# EAGLE design LightBox Schematic Updated 11-27 (EAGLE 9.2.0)
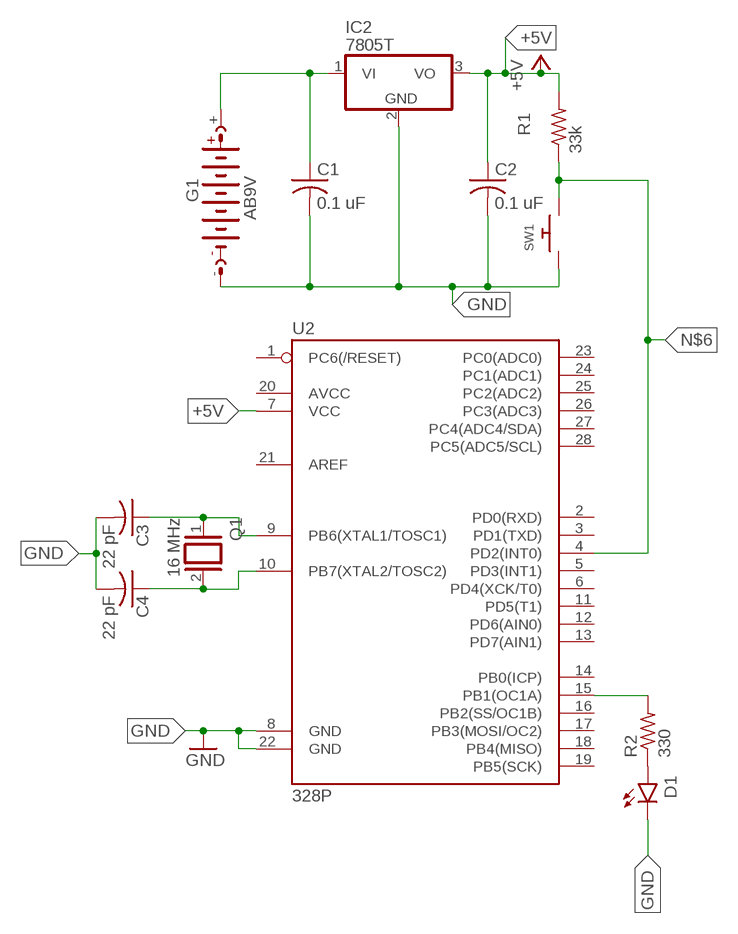
[diagram p0: schematic, sheet 1]

## Parts
C1  0.1 uF  C-USC0805  [C0805]
C2  0.1 uF  C-USC0805  [C0805]
C3  22 pF  C-USC0805  [C0805]
C4  22 pF  C-USC0805  [C0805]
D1  LED3MM  [LED_3MM]
G1  AB9V  [AB9V]
IC2  7805T  [TO220H]
Q1  16 MHz  XTAL/S  [QS]
R1  33k  R-US_R0805  [R0805]
R2  330  R-US_R0805  [R0805]
SW1  SWITCH_PUSHBUTTONEVQ-PE  [TACT_PANA-EVQ]
U2  328P  ATMEGA328P_PDIP  [DIP28]

## Nets
+5V: C2.1 IC2.3(VO) R1.2 U2.7(VCC)
GND: C1.2 C2.2 C3.2 C4.2 D1.K(C) G1.- IC2.2(GND) SW1.P$1 U2.8(GND) U2.22(GND)
N$1: C1.1 G1.+ IC2.1(VI)
N$2: R2.2 U2.15(PB1(OC1A))
N$3: C4.1 Q1.2 U2.10(PB7(XTAL2/TOSC2))
N$4: D1.A R2.1
N$5: C3.1 Q1.1 U2.9(PB6(XTAL1/TOSC1))
N$6: R1.1 SW1.P$2 U2.4(PD2(INT0))
Unconnected: U2.1(PC6(/RESET)) U2.2(PD0(RXD)) U2.3(PD1(TXD)) U2.5(PD3(INT1)) U2.6(PD4(XCK/T0)) U2.11(PD5(T1)) U2.12(PD6(AIN0)) U2.13(PD7(AIN1)) U2.14(PB0(ICP)) U2.16(PB2(SS/OC1B)) U2.17(PB3(MOSI/OC2)) U2.18(PB4(MISO)) U2.19(PB5(SCK)) U2.20(AVCC) U2.21(AREF) U2.23(PC0(ADC0)) U2.24(PC1(ADC1)) U2.25(PC2(ADC2)) U2.26(PC3(ADC3)) U2.27(PC4(ADC4/SDA)) U2.28(PC5(ADC5/SCL))

## Library data of the parts
C1-C4 = adafruit:C-US: CAPACITOR, American symbol
D1 = SparkFun-LED:LED: LED (Generic) Standard schematic elements and footprints for 5mm, 3mm, 1206, and 0603 sized LEDs. Generic LEDs with no color specified.; PROD_ID: DIO-08794
G1 = battery:AB9V: 9-V BATTERY CLIP
IC2 = adafruit:78*: Positive VOLTAGE REGULATOR Added bigger pads to the TO-92 package
Q1 = special:XTAL/S: CRYSTAL
R1 R2 = adafruit:R-US_: RESISTOR, American symbol
SW1 = adafruit:SWITCH_PUSHBUTTON: Buttons SOFTTOUCHSMD_SJ - Soft touch temporary push button (Super Junk Akihabara) Compatible with SKPMANE010 [Mouser: 688-SKPMAN] C&K_KSS = Digikey: KSS221GLFS
U2 = SparkFun-IC-Microcontroller:ATMEGA328P_PDIP: Atmel 328P Through hole ATMEGA328P uC used in the Arduino 32kb flash, 1k EEPROM, 2k SRAM Datasheet <http://www.sparkfun.com/datasheets/Components/SMD/ATMega328.pdf> SparkFun Products Storefront component: AVR 28 Pin 20MHz 32K 6A/D - ATMega328P <https://www.sparkfun.com/products/9061> (COM-09061) SparkFun Simon Says - Through-Hole Soldering Kit <https://www.sparkfun.com/products/10547> (KIT-10547) SparkFun Learn to Solder - Simon Says <https://www.sparkfun.com/products/13708> (KIT-13708) SparkFun BigTime Watch Kit <https://www.sparkfun.com/products/11734> (KIT-11734) SparkFun ClockIt <https://www.sparkfun.com/products/10930> (KIT-10930) SparkFun Serial Enabled LCD Kit <https://www.sparkfun.com/products/10097> (LCD-10097) SparkFun Simon Tilts - Through Hole Soldering Kit <https://www.sparkfun.com/products/12634> (KIT-12634) SparkFun Frequency Counter Kit <https://www.sparkfun.com/products/10140> (KIT-10140) FabFM Radio Kit <https://www.sparkfun.com/products/11043> (KIT-11043) SparkFun Binary Blaster Kit <https://www.sparkfun.com/products/12037> (KIT-12037) SparkFun Metro-Gnome <https://www.sparkfun.com/products/9236> (KIT-09236) ATmega328 with Arduino Optiboot (Uno) <https://www.sparkfun.com/products/10524> (DEV-10524); PROD_ID: IC-09136

## Net classes
0 default: width 0.508 mm, drill 0.508 mm, clearance 0.508 mm

## Board
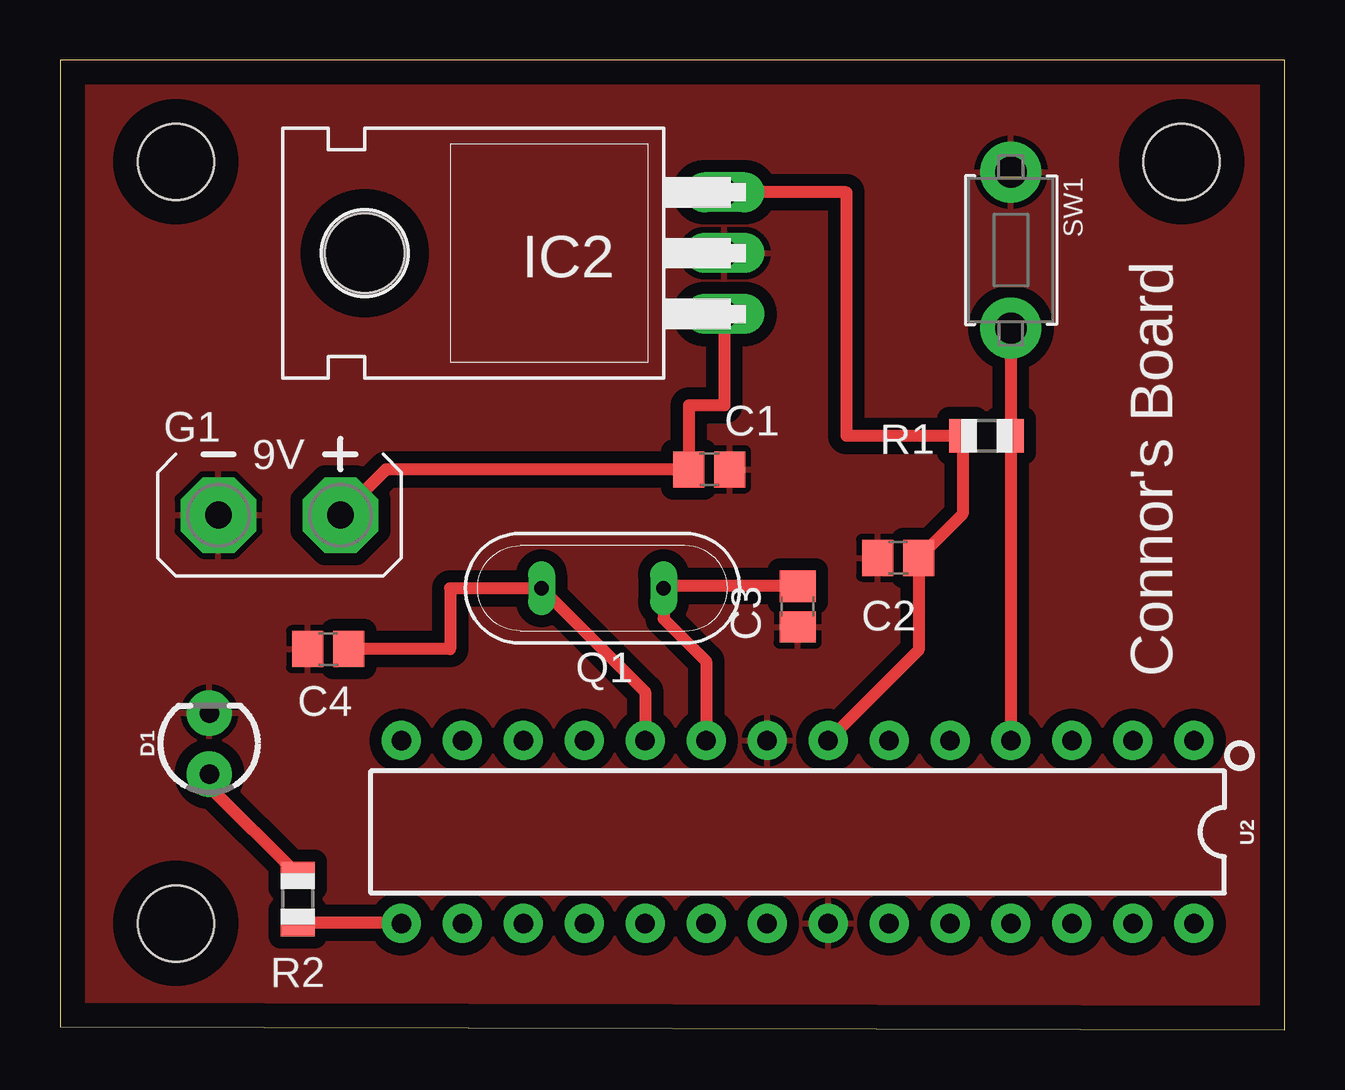
[diagram p1: board, top side]
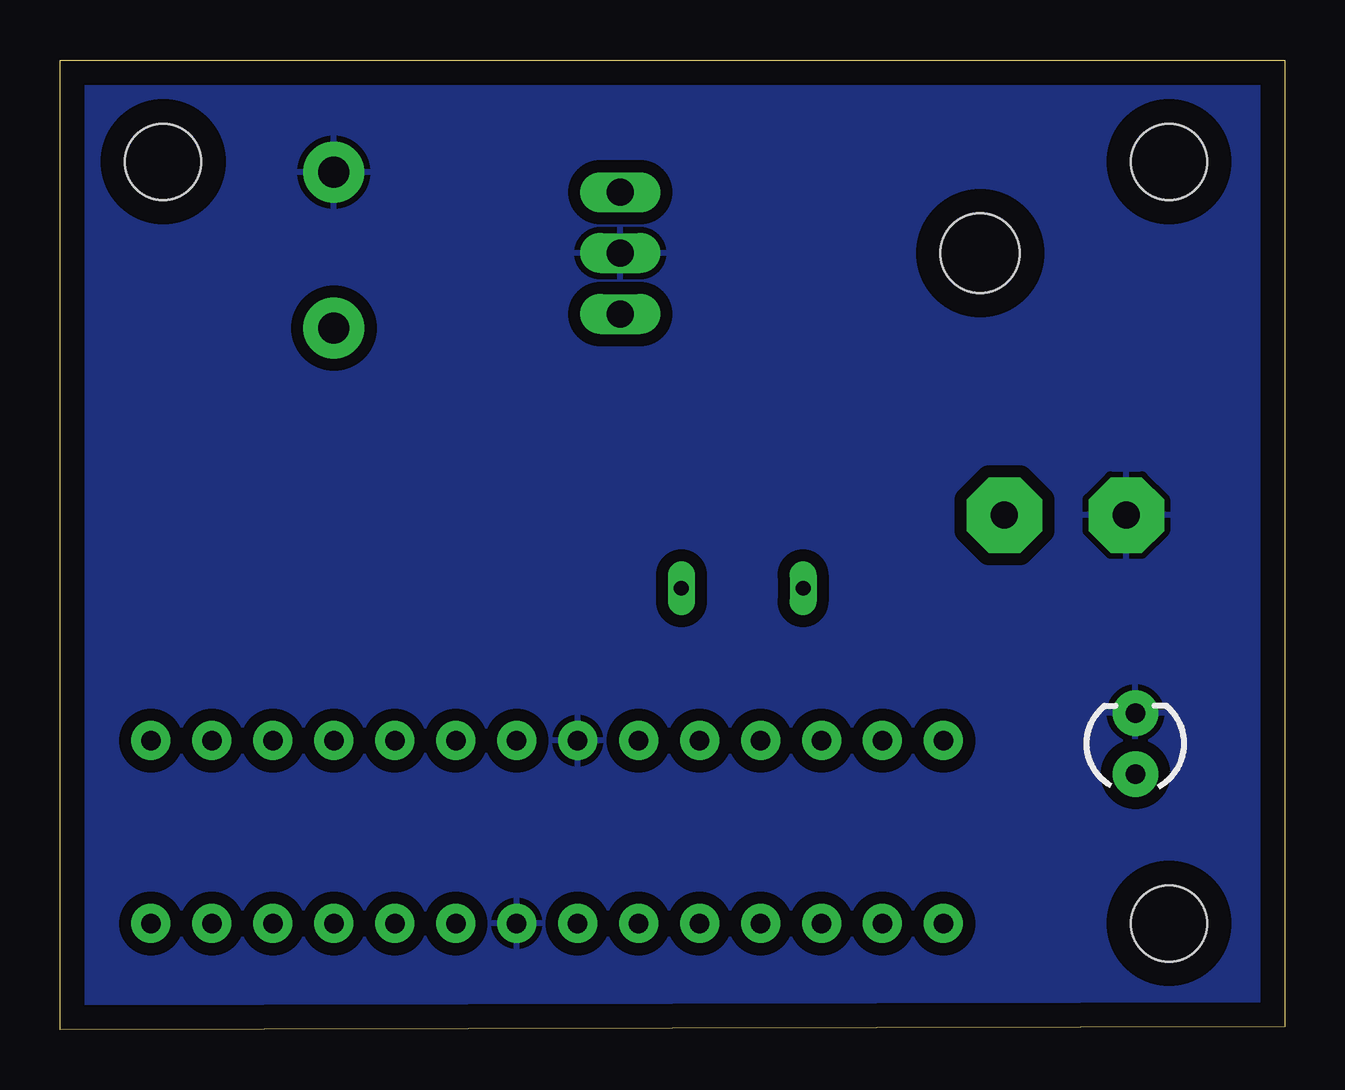
[diagram p2: board, bottom side, seen from below]

Size 51.03 x 40.44 mm. Coordinates in mm from the lower left corner, seen from the top.
Outline: 0,0.13 51.03,0 51.03,40.44 0,40.44 0,0.13
Copper layers (1*16): Top 0.035mm / dielectric 1.5mm / Bottom 0.035mm
Design rules "default *": minimum track width 12mil, minimum drill 0.35mm, track to track 6mil, track to pad 6mil, pad to pad 6mil, via to via 6mil, smd to smd 6mil, copper to edge 40mil, drill to drill 12mil, minimum pad ring 10mil, minimum via ring 8mil, stop-mask expansion 4mil, vias tented up to drill 0mil, thermal gap 10mil
Holes 3.17 mm at 4.83,36.2 4.83,4.44 46.74,36.2

### Footprints (pad centres in the part's own frame; a part is rotated, then mirrored left to right if it is on the bottom)
C0805 = smd 1.3 x 1.5: 1 -0.85,0; 2 0.85,0
LED_3MM = drill 0.813 pad 1.88: A -1.27,0; K 1.27,0
AB9V = drill 1.118 pad 3.15 octagon: + 0,2.54; - 0,-2.54
TO220H = drill 1.118 long: 1 -2.54,-10.16; 2 0,-10.16; 3 2.54,-10.16 | hole 3.302: 0,4.826
QS = drill 0.61 long: 1 -2.54,0; 2 2.54,0
R0805 = smd 1.1 x 1.4: 1 -1,0; 2 1,0
TACT_PANA-EVQ = drill 1.3 pad 2.54: P$1 -3.25,0; P$2 3.25,0
DIP28 = drill 0.813 pad 1.626: 1 -16.51,-3.81; 2 -13.97,-3.81; 3 -11.43,-3.81; 4 -8.89,-3.81; 5 -6.35,-3.81; 6 -3.81,-3.81; 7 -1.27,-3.81; 8 1.27,-3.81; 9 3.81,-3.81; 10 6.35,-3.81; 11 8.89,-3.81; 12 11.43,-3.81; 13 13.97,-3.81; 14 16.51,-3.81; 15 16.51,3.81; 16 13.97,3.81; 17 11.43,3.81; 18 8.89,3.81; 19 6.35,3.81; 20 3.81,3.81; 21 1.27,3.81; 22 -1.27,3.81; 23 -3.81,3.81; 24 -6.35,3.81; 25 -8.89,3.81; 26 -11.43,3.81; 27 -13.97,3.81; 28 -16.51,3.81

### Placement (x,y rotation side)
C1  27.05,23.37 0 top
C2  34.92,19.68 180 top
C3  30.73,17.65 270 top
C4  11.18,15.88 180 top
D1  6.22,11.94 90 top
G1  9.14,21.46 270 top
IC2  17.53,32.39 90 top
Q1  22.61,18.41 180 top
R1  38.61,24.77 180 top
R2  9.91,5.46 270 top
SW1  39.62,32.51 270 top
U2  30.73,8.26 180 top

### Tracks (layer width: path | path; a pad name or v marks a point on that pad's centre or on a via)
+5V
  Top 0.508: IC2.3 32.77,34.93 32.77,24.77 R1.2 37.61,21.52 C2.1 35.77,15.84 U2.7
GND
  pour Bottom: -0.97,42.04 55.34,42.04 55.86,-1.14 0.09,-1.14
  pour Top: -1.27,42.04 55.88,42.04 55.88,-1.14 0,-1.14 -1.27,0.13
N$1
  Top 0.508: G1.+ 13.59,23.37 C1.1 26.2,26.04 27.69,26.04 IC2.1
N$2
  Top 0.508: U2.15 14.21,4.46 R2.2
N$3
  Top 0.508: U2.10 24.38,14.1 Q1.2 16.26,18.41 16.26,15.88 C4.1
N$4
  Top 0.508: D1.A 6.22,10.14 R2.1
N$5
  Top 0.508: U2.9 26.92,15.37 25.15,17.14 Q1.1 25.23,18.5 C3.1
N$6
  Top 0.508: U2.4 39.62,24.75 R1.1 39.62,24.78 SW1.P$2

### Text on the board
tPlace: Connor's Board